# EAGLE schematic PowerPanel_SMD (EAGLE 6.4)
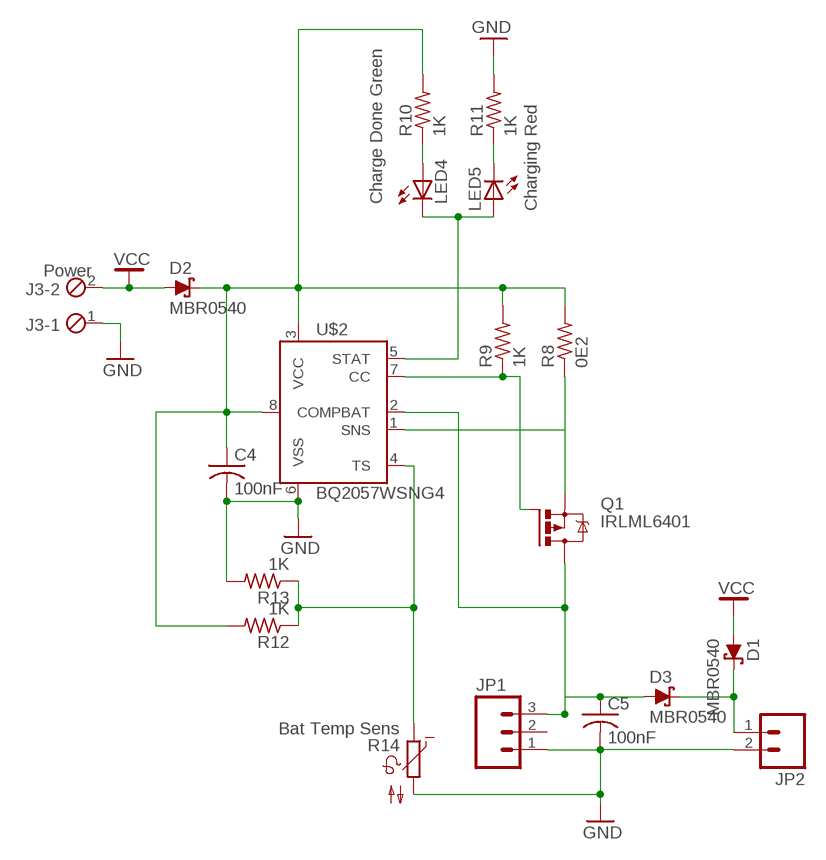
[diagram p0: schematic, sheet 1]

## Parts
C4  100nF  C-USC0805K  [C0805K]
C5  100nF  C-USC0805K  [C0805K]
D1  MBR0540  [SOD123]
D2  MBR0540  [SOD123]
D3  MBR0540  [SOD123]
J3  Power  796689-2  [796689-2]
JP1  M03LONGPADS  [1X03_LONGPADS]
JP2  M02PTH3  [1X02_LONGPADS]
LED4  Charge Done Green  LEDCHIPLED_0805  [CHIPLED_0805]
LED5  Charging Red  LEDCHIPLED_0805  [CHIPLED_0805]
Q1  IRLML6401  IRLML5203  [MICRO3]
R8  0E2  R-US_M1206  [M1206]
R9  1K  R-US_R0805  [R0805]
R10  1K  R-US_R0805  [R0805]
R11  1K  R-US_R0805  [R0805]
R12  1K  R-US_R0805  [R0805]
R13  1K  R-US_R0805  [R0805]
R14  Bat Temp Sens  NTC640  [P640]
U$2  BQ2057WSNG4  [D_R-PDSO-G8]

## Nets
GND: C4.2 C5.2 J3.1 JP1.1 JP2.2 R11.2 R13.2 R14.2 U$2.6(VSS)
N$1: D1.C D3.C JP2.1
N$8: LED4.C LED5.A U$2.5(STAT)
N$20: C5.1 D3.A JP1.3 Q1.3(D) U$2.2(BAT)
N$27: Q1.2(S) R8.1 U$2.1(SNS)
N$29: Q1.1(G) R9.1 U$2.7(CC)
N$30: LED5.C R11.1
N$31: LED4.A R10.1
N$32: R12.1 R13.1 R14.1 U$2.4(TS)
N$34: C4.1 D2.C R8.2 R9.2 R10.2 R12.2 U$2.3(VCC) U$2.8(COMP)
VCC: D1.A D2.A J3.2
Unconnected: JP1.2

## Library data of the parts
C4 C5 = resistor:C-US: CAPACITOR, American symbol
D1-D3 = diode:MBR0540: schottky diode, 0.5A, 40V ON Semiconductor
J3 = con-tyco:796689-2: TERMINAL BLOCK 5 mm, Euro Style
JP1 = SparkFun:M03: Header 3 Standard 3-pin 0.1" header. Use with straight break away headers (SKU : PRT-00116), right angle break away headers (PRT-00553), swiss pins (PRT-00743), machine pins (PRT-00117), and female headers (PRT-00115). Molex polarized connector foot print use with SKU : PRT-08232 with associated crimp pins and housings.
JP2 = SparkFun:M02: Header 2 Standard 2-pin 0.1" header. Use with straight break away headers (SKU : PRT-00116), right angle break away headers (PRT-00553), swiss pins (PRT-00743), machine pins (PRT-00117), and female headers (PRT-00115). Molex polarized connector foot print use with SKU : PRT-08233 with associated crimp pins and housings.
LED4 LED5 = led:LED: LED OSRAM: - CHIPLED LG R971, LG N971, LY N971, LG Q971, LY Q971, LO R971, LY R971 LH N974, LH R974 LS Q976, LO Q976, LY Q976 LO Q996 - Hyper CHIPLED LW Q18S LB Q993, LB Q99A, LB R99A - SideLED LS A670, LO A670, LY A670, LG A670, LP A670 LB A673, LV A673, LT A673, LW A673 LH A674 LY A675 LS A676, LA A676, LO A676, LY A676, LW A676 LS A679, LY A679, LG A679 - Hyper Micro SIDELED® LS Y876, LA Y876, LO Y876, LY Y876 LT Y87S - SmartLED LW L88C, LW L88S LB L89C, LB L89S, LG L890 LS L89K, LO L89K, LY L89K LS L896, LA L896, LO L896, LY L896 - TOPLED LS T670, LO T670, LY T670, LG T670, LP T670 LSG T670, LSP T670, LSY T670, LOP T670, LYG T670 LG T671, LOG T671, LSG T671 LB T673, LV T673, LT T673, LW T673 LH T674 LS T676, LA T676, LO T676, LY T676, LB T676, LH T676, LSB T676, LW T676 LB T67C, LV T67C, LT T67C, LS T67K, LO T67K, LY T67K, LW E67C LS E67B, LA E67B, LO E67B, LY E67B, LB E67C, LV E67C, LT E67C LW T67C LS T679, LY T679, LG T679 LS T770, LO T770, LY T770, LG T770, LP T770 LB T773, LV T773, LT T773, LW T773 LH T774 LS E675, LA E675, LY E675, LS T675 LS T776, LA T776, LO T776, LY T776, LB T776 LHGB T686 LT T68C, LB T68C - Hyper Mini TOPLED® LB M676 - Mini TOPLED Santana® LG M470 LS M47K, LO M47K, LY M47K Source: http://www.osram.convergy.de LUXEON: - LUMILED® LXK2-PW12-R00, LXK2-PW12-S00, LXK2-PW14-U00, LXK2-PW14-V00 LXK2-PM12-R00, LXK2-PM12-S00, LXK2-PM14-U00 LXK2-PE12-Q00, LXK2-PE12-R00, LXK2-PE12-S00, LXK2-PE14-T00, LXK2-PE14-U00 LXK2-PB12-K00, LXK2-PB12-L00, LXK2-PB12-M00, LXK2-PB14-N00, LXK2-PB14-P00, LXK2-PB14-Q00 LXK2-PR12-L00, LXK2-PR12-M00, LXK2-PR14-Q00, LXK2-PR14-R00 LXK2-PD12-Q00, LXK2-PD12-R00, LXK2-PD12-S00 LXK2-PH12-R00, LXK2-PH12-S00 LXK2-PL12-P00, LXK2-PL12-Q00, LXK2-PL12-R00 Source: www.luxeon.com KINGBRIGHT: KA-3528ASYC Source: www.kingbright.com
Q1 = transistor-power:IRLML5203: HEXFET P-Channel Power MOSFET
R8-R13 = resistor:R-US_: RESISTOR, American symbol
R14 = ptc-ntc:NTC640: PHILIPS NTC; OC_FARNELL: unknown; OC_NEWARK: unknown
U$2 = RobThePyro:BQ2057WSNG4: TI BQ2057WSNG4 1-2Cell Li-ion / lipo charger IC http://www.ti.com/lit/ds/symlink/bq2057w.pdf